# EAGLE design FLEXQCMV2.1 (EAGLE 7.2.0)
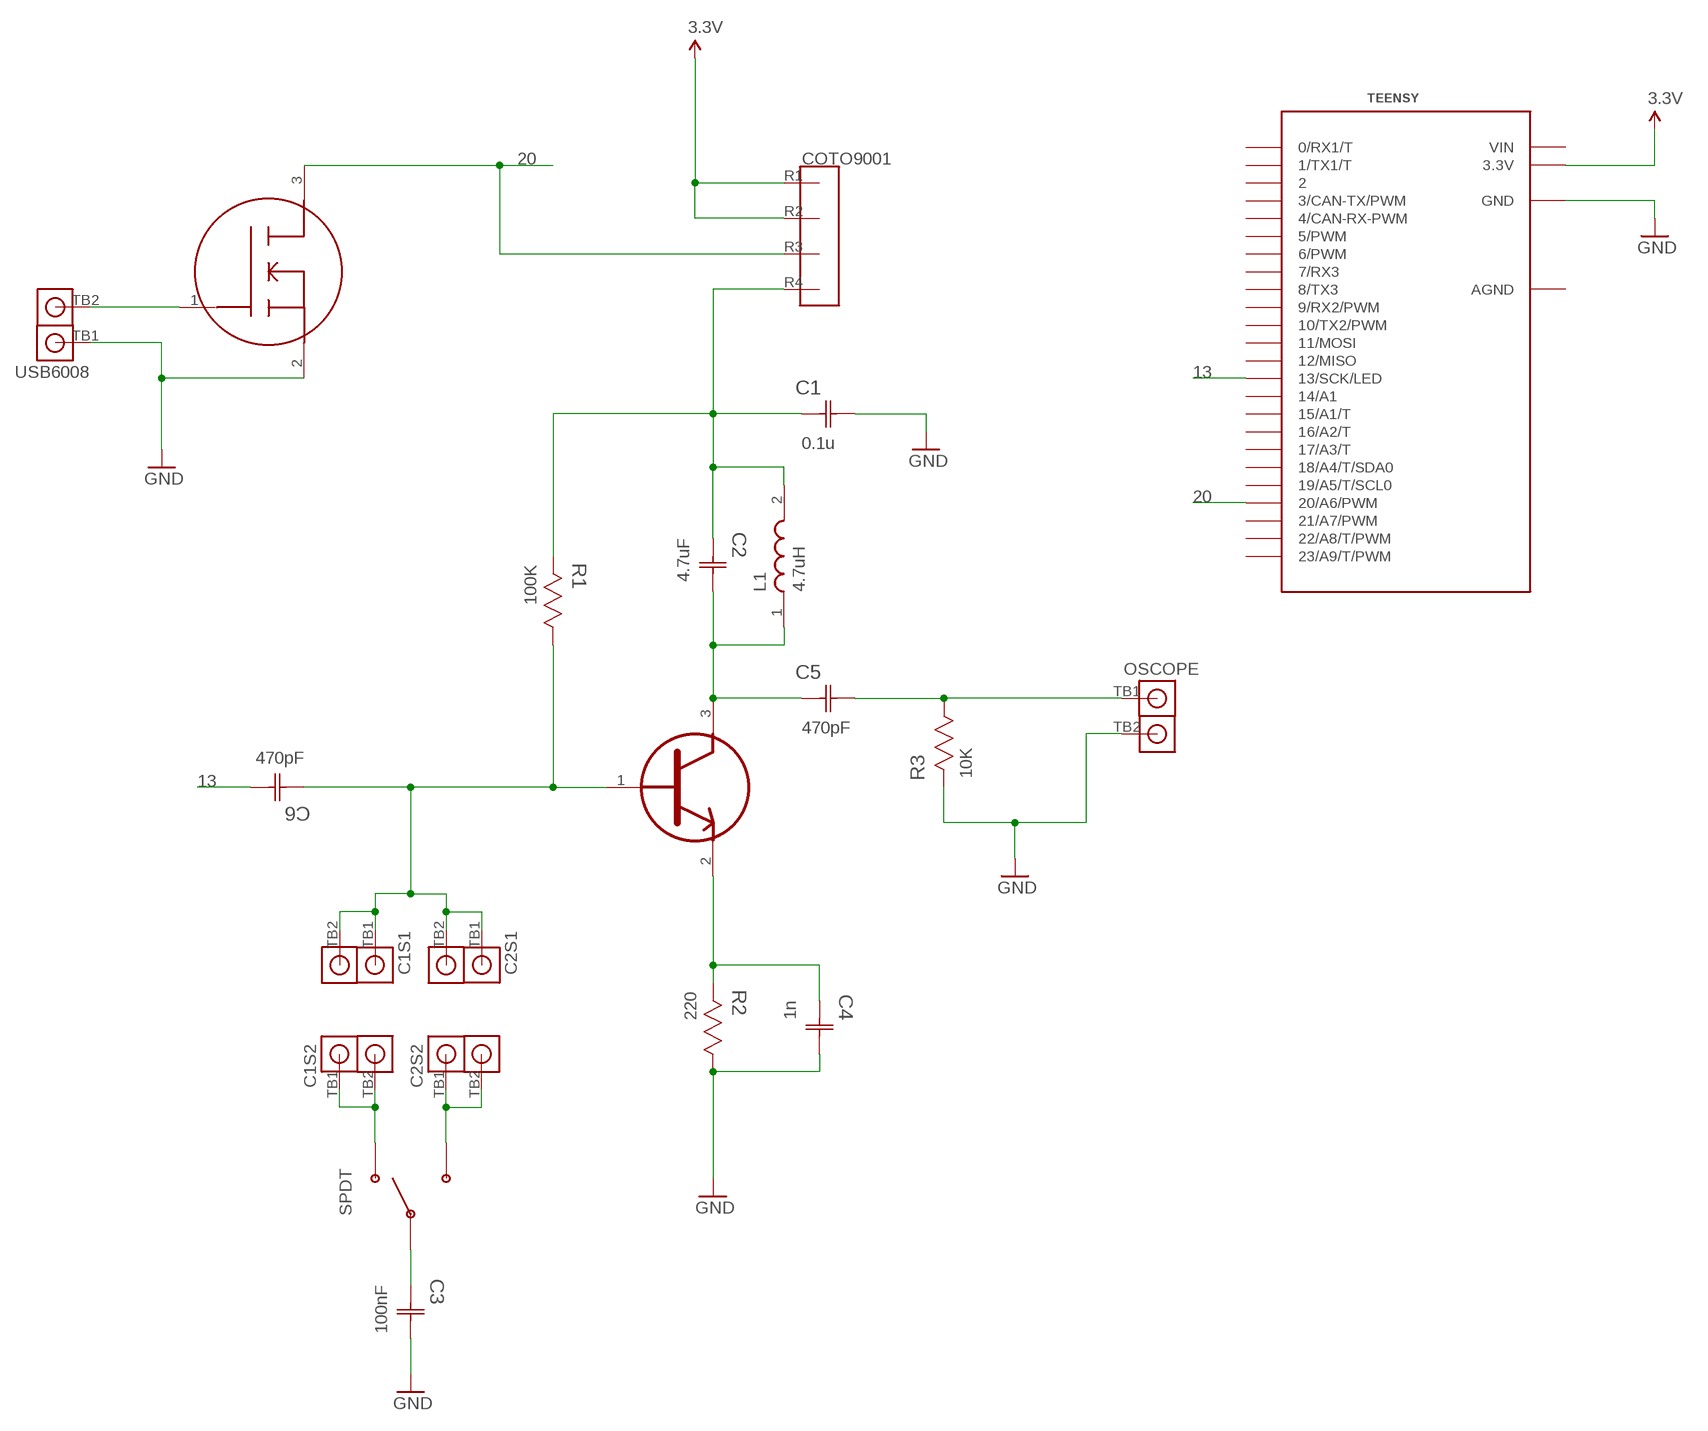
[diagram p0: schematic, sheet 1]

## Parts
C1  0.1u  C1206C104K1RACTU  [CAPC3216X88N]
C1S1  TERMBLOCKX2  [TERMBLOCKX2]
C1S2  TERMBLOCKX2  [TERMBLOCKX2]
C2  4.7uF  C1206C475K3RACTU  [CAPC3216X180N]
C2S1  TERMBLOCKX2  [TERMBLOCKX2]
C2S2  TERMBLOCKX2  [TERMBLOCKX2]
C3  100nF  C1206C104K1RACTU  [CAPC3216X88N]
C4  1n  C1206C103K5RACTU  [CAPC3216X88N]
C5  470pF  C1206C474K3RACTU  [CAPC3216X100N]
C6  470pF  C1206C474K3RACTU  [CAPC3216X100N]
COTO9001  COTO9001  [COTO9001]
L1  4.7uH  B82422A1472K100  [INDC3225X210N]
OSCOPE  TERMBLOCKX2  [TERMBLOCKX2]
R1  100K  CRCW1206100KJNEA  [RESC3216X71N]
R2  220  CRCW1206220RJNEA  [RESC3216X71N]
R3  10K  CRCW120610K0FKEA  [RESC3216X71N]
SPDT  SPDTSWITCH  [SPDTSWITCH]
TEENSY  TEENSY_3.1_DIL  [TEENSY3-DIL]
U1  FET  2N7002K  [SOT95P230X110-3N]
U2  BJT  BC847C  [SOT95P230X110-3N]
USB6008  TERMBLOCKX2  [TERMBLOCKX2]

## Nets
3.3V: COTO9001.R1 COTO9001.R2 TEENSY.3.3V
13: C6.2(C2) TEENSY.13(13/SCK/LED)
20: COTO9001.R3 TEENSY.20/A6(20/A6/PWM) U1.3(D)
GND: C1.2(C2) C3.2(C2) C4.2(C2) OSCOPE.TB2 R2.1 R3.2 TEENSY.GND U1.2(S) USB6008.TB1
N$1: U1.1(G) USB6008.TB2
N$2: C4.1(C1) R2.2 U2.2(E)
N$3: C1S2.TB1 C1S2.TB2 SPDT.SW1
N$4: C1.1(C1) C2.1(C1) COTO9001.R4 L1.2 R1.2
N$5: C1S1.TB1 C1S1.TB2 C2S1.TB1 C2S1.TB2 C6.1(C1) R1.1 U2.1(B)
N$7: C2S2.TB1 C2S2.TB2 SPDT.SW3
N$8: C3.1(C1) SPDT.SW2
N$9: C2.2(C2) C5.1(C1) L1.1 U2.3(C)
N$11: C5.2(C2) OSCOPE.TB1 R3.1
Unconnected: TEENSY.0(0/RX1/T) TEENSY.1(1/TX1/T) TEENSY.2 TEENSY.3(3/CAN-TX/PWM) TEENSY.4(4/CAN-RX-PWM) TEENSY.5(5/PWM) TEENSY.6(6/PWM) TEENSY.7(7/RX3) TEENSY.8(8/TX3) TEENSY.9(9/RX2/PWM) TEENSY.10(10/TX2/PWM) TEENSY.11(11/MOSI) TEENSY.12(12/MISO) TEENSY.14/A0(14/A1) TEENSY.15/A1(15/A1/T) TEENSY.16/A2(16/A2/T) TEENSY.17/A3(17/A3/T) TEENSY.18/A4(18/A4/T/SDA0) TEENSY.19/A5(19/A5/T/SCL0) TEENSY.21/A7(21/A7/PWM) TEENSY.22/A8(22/A8/T/PWM) TEENSY.23/A9(23/A9/T/PWM)

## Power pins joined to a net without a drawn wire
AGND: TEENSY.AGND
VIN: TEENSY.VIN

## Library data of the parts
C1 = Kemet_By_element14_Batch_1:C1206C104K1RACTU: CAPACITOR, 1206; MPN: C1206C104K1RACTU; OC_FARNELL: 1414714; OC_NEWARK: 85C2205; SUPPLIER: Kemet; TOLERANCE: ±10%; VALUE: 100nF; VOLTAGERATING: 100V
C1S1 C1S2 C2S1 C2S2 OSCOPE USB6008 = FLEXQCMLIBRARY:TERMBLOCKX2
C2 = Kemet_By_element14_Batch_1:C1206C475K3RACTU: CAPACITOR, 1206; MPN: C1206C475K3RACTU; OC_FARNELL: 1288211; OC_NEWARK: 88K0224; SUPPLIER: Kemet; TOLERANCE: ±10%; VOLTAGERATING: 25V
C3 = Kemet_By_element14_Batch_1:C1206C104K1RACTU: CAPACITOR, 1206; MPN: C1206C104K1RACTU; OC_FARNELL: 1414714; OC_NEWARK: 85C2205; SUPPLIER: Kemet; TOLERANCE: ±10%; VOLTAGERATING: 100V
C4 = Kemet_By_element14_Batch_1:C1206C103K5RACTU: CAPACITOR, 1206; MPN: C1206C103K5RACTU; OC_FARNELL: 1414713; OC_NEWARK: 61H7741; SUPPLIER: Kemet; TOLERANCE: ±10%; VALUE: 10nF; VOLTAGERATING: 50V
C5 C6 = Kemet_By_element14_Batch_1:C1206C474K3RACTU: CAPACITOR, 1206; MPN: C1206C474K3RACTU; OC_FARNELL: 1288280; OC_NEWARK: 25M8811; SUPPLIER: Kemet; TOLERANCE: ±10%; VALUE: 470nF; VOLTAGERATING: 25V
COTO9001 = FLEXQCMLIBRARY:COTO9001
L1 = Epcos_By_element14_Batch_1:B82422A1472K100: SMT inductors; MPN: B82422A1472K100; OC_FARNELL: 1644345; OC_NEWARK: 22C0379; SUPPLIER: EPCOS; TOLERANCE: ±10%
R1 = Vishay_By_element14_Batch_1:CRCW1206100KJNEA: RESISTOR, 1206; MPN: CRCW1206100KJNEA; OC_FARNELL: 1534576; OC_NEWARK: 59M6947; SUPPLIER: Vishay; TOLERANCE: ±5%; VALUE: 100K Ohms; WATTAGE: 0.25W
R2 = Vishay_By_element14_Batch_1:CRCW1206220RJNEA: RESISTOR, 1206; MPN: CRCW1206220RJNEA; OC_FARNELL: -; OC_NEWARK: 59M6970; SUPPLIER: Vishay; TOLERANCE: ±5%; VALUE: 220 Ohms; WATTAGE: 0.25W
R3 = Vishay_By_element14_Batch_1:CRCW120610K0FKEA: RESISTOR, 1206; MPN: CRCW120610K0FKEA; OC_FARNELL: 1469970; OC_NEWARK: 53K1907; SUPPLIER: Vishay; TOLERANCE: ±1%; VALUE: 10K Ohms; WATTAGE: 0.25W
SPDT = FLEXQCMLIBRARY:SPDTSWITCH
TEENSY = Teensy_3_and_LC_Series_Boards_v1.0:TEENSY_3.1_DIL: Teensy 3.1 or 3.2 in a DIL Layout.
U1 = NXP_By_element14_Batch_1:2N7002K: logic level FET; MPN: 2N7002K; OC_FARNELL: 1758065; OC_NEWARK: -; PACKAGE: SOT-3; SUPPLIER: NXP Semiconductors
U2 = NXP_By_element14_Batch_1:BC847C

## Board
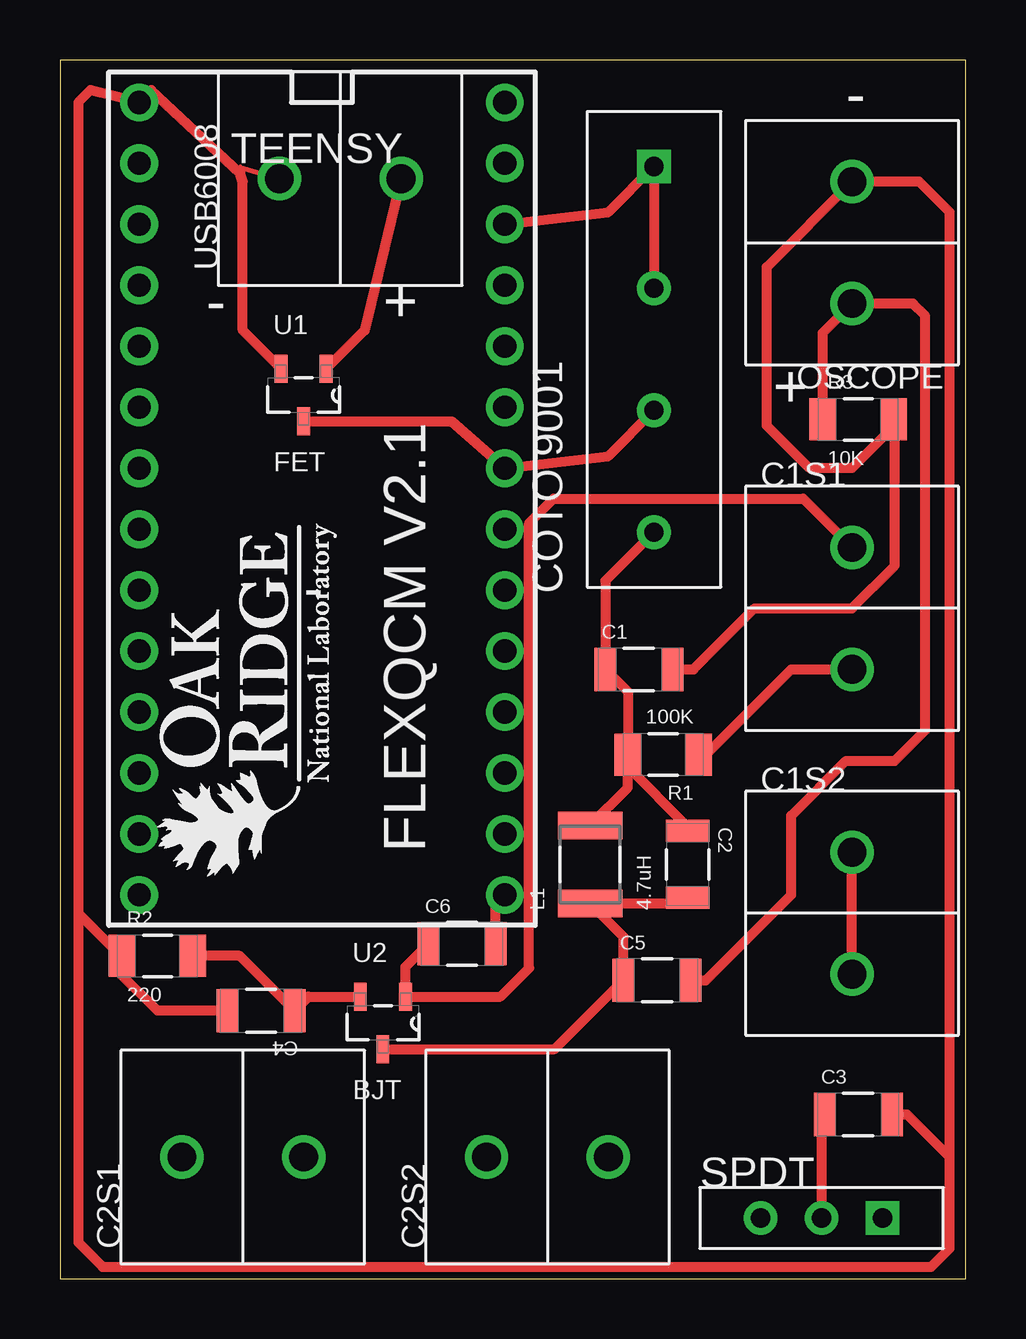
[diagram p1: board, top side]
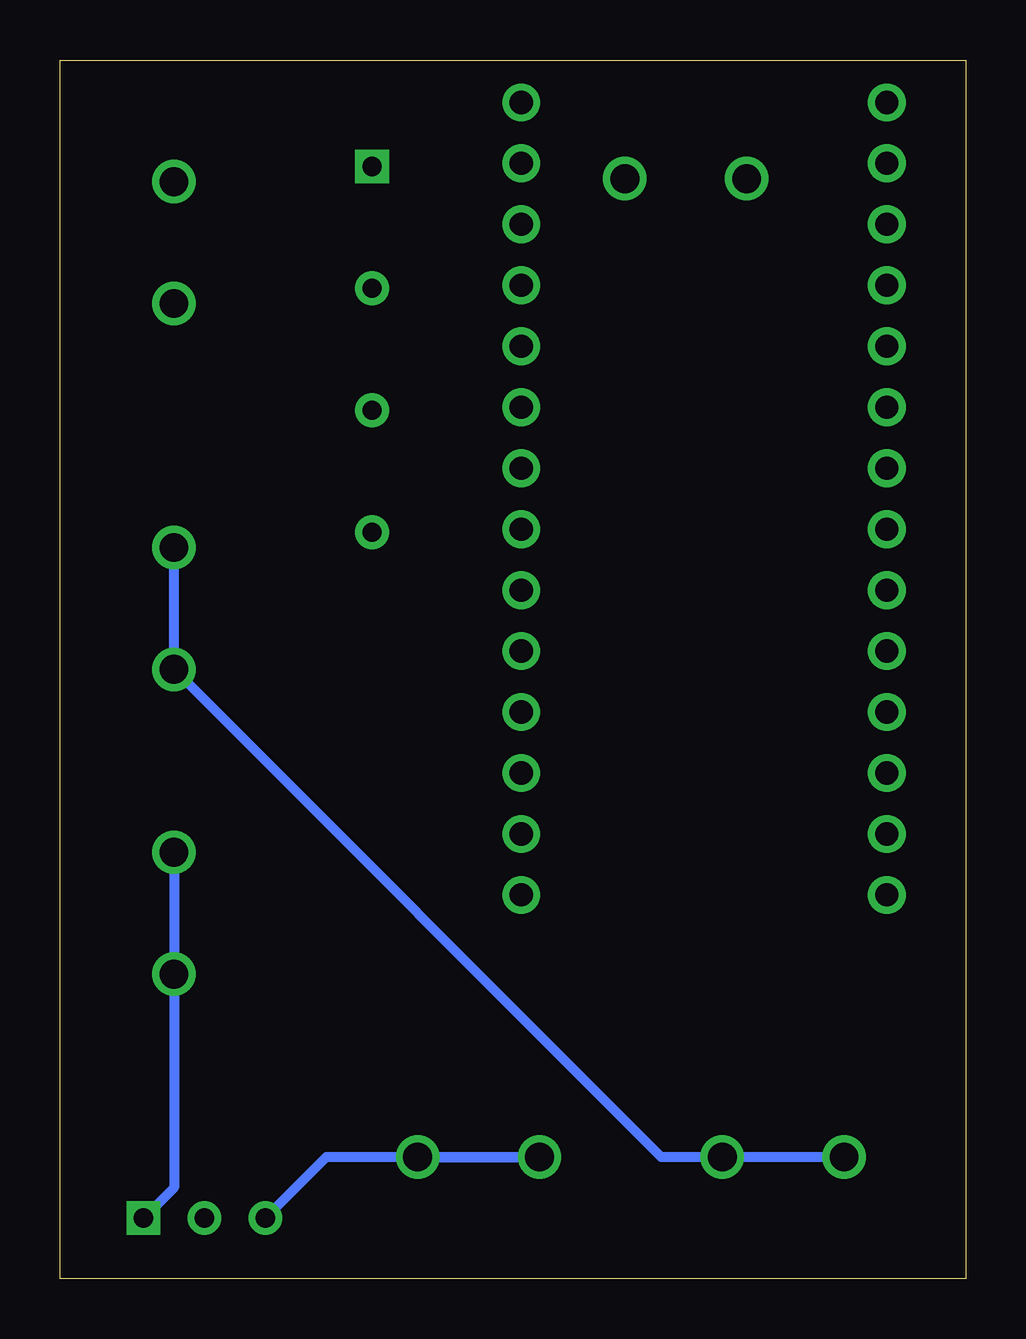
[diagram p2: board, bottom side, seen from below]

Size 37.77 x 50.79 mm. Coordinates in mm from the lower left corner, seen from the top.
Outline: 0,0 37.77,0 37.77,50.79 0,50.79 0,0
Copper layers (1*16): Top 0.035mm / dielectric 1.5mm / Bottom 0.035mm
Design rules "SparkFun": minimum track width 8mil, minimum drill 20mil, track to track 8mil, track to pad 8mil, pad to pad 8mil, via to via 8mil, smd to smd 8mil, copper to edge 10mil, drill to drill 8mil, minimum pad ring 12mil, minimum via ring 10mil, stop-mask expansion 4mil, vias tented up to drill 25mil, thermal gap 10mil

### Footprints (pad centres in the part's own frame; a part is rotated, then mirrored left to right if it is on the bottom)
CAPC3216X88N = smd 0.914 x 1.803: 1 -1.397,0; 2 1.397,0
TERMBLOCKX2 = drill 1.2: TB1 0,2.54; TB2 0,-2.54
CAPC3216X180N = smd 0.914 x 1.803: 1 -1.397,0; 2 1.397,0
CAPC3216X100N = smd 0.914 x 1.803: 1 -1.397,0; 2 1.397,0
COTO9001 = drill 0.8 square: R1 0,7.62 | drill 0.8: R2 0,2.54; R3 0,-2.54; R4 0,-7.62
INDC3225X210N = smd 1.143 x 2.692: 1 -1.626,0; 2 1.626,0
RESC3216X71N = smd 1.118 x 1.753: 1 -1.473,0; 2 1.473,0
SPDTSWITCH = drill 0.8 square: SW1 0,2.54 | drill 0.8: SW2 0,0; SW3 0,-2.54
TEENSY3-DIL = drill 0.965: 0 -7.62,13.97; 1 -7.62,11.43; 2 -7.62,8.89; 3 -7.62,6.35; 3.3V 7.62,11.43; 4 -7.62,3.81; 5 -7.62,1.27; 6 -7.62,-1.27; 7 -7.62,-3.81; 8 -7.62,-6.35; 9 -7.62,-8.89; 10 -7.62,-11.43; 11 -7.62,-13.97; 12 -7.62,-16.51; 13 7.62,-16.51; 14/A0 7.62,-13.97; 15/A1 7.62,-11.43; 16/A2 7.62,-8.89; 17/A3 7.62,-6.35; 18/A4 7.62,-3.81; 19/A5 7.62,-1.27; 20/A6 7.62,1.27; 21/A7 7.62,3.81; 22/A8 7.62,6.35; 23/A9 7.62,8.89; AGND 7.62,13.97; GND -7.62,16.51; VIN 7.62,16.51
SOT95P230X110-3N = smd 1.168 x 0.533: 1 -1.092,0.94; 2 -1.092,-0.94; 3 1.092,0

### Placement (x,y rotation side)
C1  24.13,25.4 0 top
C1S1  33.02,27.94 0 top
C1S2  33.02,15.24 0 top
C2  26.16,17.27 270 top
C2S1  7.62,5.08 90 top
C2S2  20.32,5.08 90 top
C3  33.27,6.86 0 top
C4  8.38,11.18 180 top
C5  24.89,12.45 0 top
C6  16.76,13.97 0 top
COTO9001  24.77,38.73 0 top
L1  22.1,17.27 90 top
OSCOPE  33.02,43.18 180 top
R1  25.15,21.84 180 top
R2  4.06,13.46 0 top
R3  33.27,35.81 0 top
SPDT  31.75,2.54 270 top
TEENSY  10.92,32.51 0 top
U1  10.16,36.83 270 top
U2  13.46,10.67 270 top
U$1  [ORNLLOGOV9]  11.68,16.51 90 top
USB6008  11.68,45.85 90 top

### Tracks (layer width: path | path; a pad name or v marks a point on that pad's centre or on a via)
3.3V
  Top 0.406: TEENSY.3.3V 22.86,44.45 COTO9001.R1 COTO9001.R2
13
  Top 0.406: C6.2 18.16,16.13 TEENSY.13
20
  Top 0.406: U1.3 16.33,35.74 TEENSY.20/A6 22.86,34.29 COTO9001.R3
GND
  Top 0.203: 7.52,46.08 7.52,46.33 USB6008.TB1
  Top 0.406: 0.76,15.24 0.76,49.02 1.27,49.53 TEENSY.GND 3.81,49.53 7.52,46.08 7.62,45.72 7.62,39.52 U1.2 | 0.76,15.24 0.76,1.52 1.78,0.51 36.32,0.51 37.08,1.27 37.08,5.08 | 37.08,5.08 37.08,44.45 35.81,45.72 OSCOPE.TB2 29.46,42.16 29.46,35.56 31.24,33.78 33.02,33.78 34.75,35.51 R3.2 34.8,35.76 34.8,29.72 33.02,27.94 28.96,27.94 26.42,25.4 C1.2 | C3.2 35.31,6.86 37.08,5.08 | C4.2 4.06,11.18 2.54,12.7 2.54,13.41 R2.1 2.54,13.46 0.76,15.24
N$1
  Top 0.406: USB6008.TB2 12.7,39.52 U1.1
N$2
  Top 0.406: R2.2 7.49,13.46 C4.1 10.36,11.76 U2.2
N$3
  Top 0.406: C1S2.TB2 C1S2.TB1
  Bottom 0.406: C1S2.TB1 33.02,3.81 SPDT.SW1
N$4
  Top 0.406: COTO9001.R4 22.73,29.08 C1.1 23.67,24.46 R1.2 23.67,21.34 | L1.2 23.67,20.47 23.67,21.34 | C2.1 26.16,18.85 23.67,21.34
N$5
  Top 0.406: C6.1 14.4,13.01 U2.1 18.36,11.76 19.56,12.95 19.56,31.5 20.57,32.51 30.99,32.51 C1S1.TB1 | R1.1 26.92,21.84 30.48,25.4 C1S1.TB2
  Bottom 0.406: C2S1.TB1 C2S1.TB2 12.7,5.08 C1S1.TB2 C1S1.TB1
N$7
  Bottom 0.406: C2S2.TB2 C2S2.TB1 26.67,5.08 SPDT.SW3
N$8
  Top 0.406: SPDT.SW2 31.75,6.73 C3.1
N$9
  Top 0.406: U2.3 20.62,9.58 C5.1 23.5,14.25 L1.1 25.93,15.65 C2.2
N$11
  Top 0.406: C5.2 26.92,12.45 30.48,16 30.48,19.3 32.77,21.59 34.8,21.59 36.07,22.86 36.07,40.13 35.56,40.64 OSCOPE.TB1 31.8,39.42 R3.1

### Text on the board
tPlace: - | - | + | + | - | FLEXQCM V2.1